# Altium project passthrough_module.PrjPcb
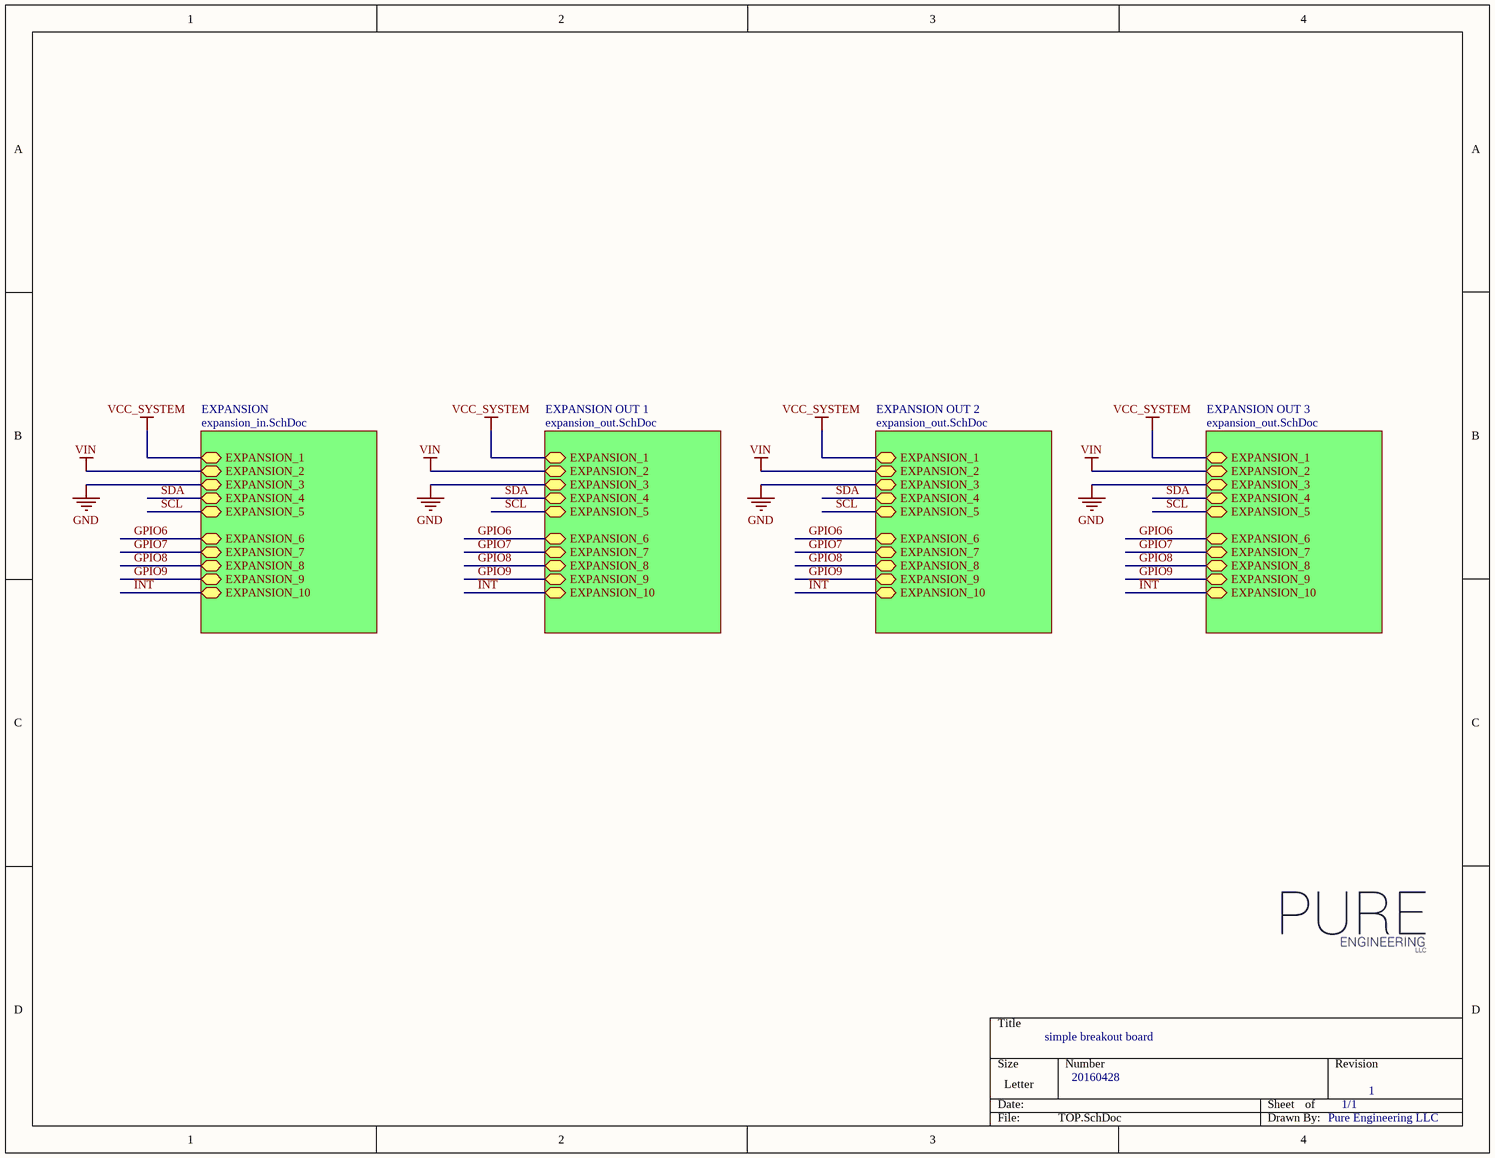
[diagram p0: TOP.SchDoc]
3 sheets, 4 parts. Net scope: hierarchical (ports join the sheet entries above them; power ports are global).
Board file: passthrough_module.PcbDoc
Sheets:
  TOP.SchDoc
    EXPANSION = expansion_in.SchDoc
    EXPANSION OUT 1 = expansion_out.SchDoc
    EXPANSION OUT 2 = expansion_out.SchDoc
    EXPANSION OUT 3 = expansion_out.SchDoc

## Sheet TOP.SchDoc
size Letter; SheetNumber: 1; SheetTotal: 4

### Sub-sheets
EXPANSION = expansion_in.SchDoc: EXPANSION_1, EXPANSION_2, EXPANSION_3, EXPANSION_4, EXPANSION_5, EXPANSION_10, EXPANSION_9, EXPANSION_8, EXPANSION_7, EXPANSION_6
EXPANSION OUT 1 = expansion_out.SchDoc: EXPANSION_1, EXPANSION_2, EXPANSION_3, EXPANSION_4, EXPANSION_5, EXPANSION_10, EXPANSION_9, EXPANSION_8, EXPANSION_7, EXPANSION_6
EXPANSION OUT 2 = expansion_out.SchDoc: EXPANSION_1, EXPANSION_2, EXPANSION_3, EXPANSION_4, EXPANSION_5, EXPANSION_10, EXPANSION_9, EXPANSION_8, EXPANSION_7, EXPANSION_6
EXPANSION OUT 3 = expansion_out.SchDoc: EXPANSION_1, EXPANSION_2, EXPANSION_3, EXPANSION_4, EXPANSION_5, EXPANSION_10, EXPANSION_9, EXPANSION_8, EXPANSION_7, EXPANSION_6

### Nets
GND: sheet EXPANSION/EXPANSION_3, sheet EXPANSION OUT 1/EXPANSION_3, sheet EXPANSION OUT 2/EXPANSION_3, sheet EXPANSION OUT 3/EXPANSION_3
VCC_SYSTEM: sheet EXPANSION/EXPANSION_1, sheet EXPANSION OUT 1/EXPANSION_1, sheet EXPANSION OUT 2/EXPANSION_1, sheet EXPANSION OUT 3/EXPANSION_1
VIN: sheet EXPANSION/EXPANSION_2, sheet EXPANSION OUT 1/EXPANSION_2, sheet EXPANSION OUT 2/EXPANSION_2, sheet EXPANSION OUT 3/EXPANSION_2
GPIO6: sheet EXPANSION/EXPANSION_6, sheet EXPANSION OUT 1/EXPANSION_6, sheet EXPANSION OUT 2/EXPANSION_6, sheet EXPANSION OUT 3/EXPANSION_6
GPIO7: sheet EXPANSION/EXPANSION_7, sheet EXPANSION OUT 1/EXPANSION_7, sheet EXPANSION OUT 2/EXPANSION_7, sheet EXPANSION OUT 3/EXPANSION_7
GPIO8: sheet EXPANSION/EXPANSION_8, sheet EXPANSION OUT 1/EXPANSION_8, sheet EXPANSION OUT 2/EXPANSION_8, sheet EXPANSION OUT 3/EXPANSION_8
GPIO9: sheet EXPANSION/EXPANSION_9, sheet EXPANSION OUT 1/EXPANSION_9, sheet EXPANSION OUT 2/EXPANSION_9, sheet EXPANSION OUT 3/EXPANSION_9
~{INT}: sheet EXPANSION/EXPANSION_10, sheet EXPANSION OUT 1/EXPANSION_10, sheet EXPANSION OUT 2/EXPANSION_10, sheet EXPANSION OUT 3/EXPANSION_10
SCL: sheet EXPANSION/EXPANSION_5, sheet EXPANSION OUT 1/EXPANSION_5, sheet EXPANSION OUT 2/EXPANSION_5, sheet EXPANSION OUT 3/EXPANSION_5
SDA: sheet EXPANSION/EXPANSION_4, sheet EXPANSION OUT 1/EXPANSION_4, sheet EXPANSION OUT 2/EXPANSION_4, sheet EXPANSION OUT 3/EXPANSION_4

### Notes on the sheet
- simple breakout board
- 20160428
- 1/1
- 1
- Pure Engineering LLC

## Sheet expansion_in.SchDoc
size A
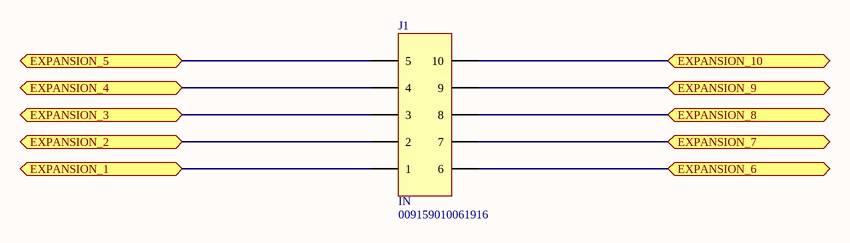
[diagram p1: expansion_in.SchDoc]

### Parts
J1  IN  [009159010061916_BACK]

### Ports
EXPANSION_1, EXPANSION_2, EXPANSION_3, EXPANSION_4, EXPANSION_5, EXPANSION_6, EXPANSION_7, EXPANSION_8, EXPANSION_9, EXPANSION_10

### Nets
GND: J1.3 ; port EXPANSION_3
VCC_SYSTEM: J1.1 ; port EXPANSION_1
VIN: J1.2 ; port EXPANSION_2
GPIO6: J1.6 ; port EXPANSION_6
GPIO7: J1.7 ; port EXPANSION_7
GPIO8: J1.8 ; port EXPANSION_8
GPIO9: J1.9 ; port EXPANSION_9
~{INT}: J1.10 ; port EXPANSION_10
SCL: J1.5 ; port EXPANSION_5
SDA: J1.4 ; port EXPANSION_4

### Library data of the parts
J1 = 009159010061916: CONN SSL BRIDGE 10POS 2MM Open Ended Card Edge: 00-9159; MANUFACTURER: AVX Corporation; VALIDATED BY: NV; DISTRIBUTOR: DIGI-KEY; DISTRIBUTOR P/N: 478-8659-ND; CREATED BY: SO 7 2014; COST: 1.06; MANUFACTURER P/N: 009159010061916

## Sheet expansion_out.SchDoc
size A
Used 3 times, as channels EXPANSION OUT 1, EXPANSION OUT 2, EXPANSION OUT 3. Parts and nets are listed once, with the designators drawn on the sheet.
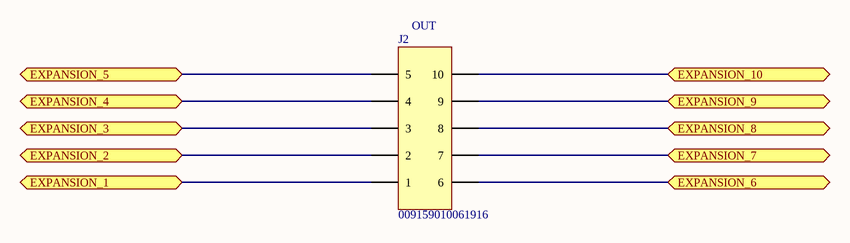
[diagram p2: expansion_out.SchDoc]

### Parts
J2  OUT  [009159010061916_FRONT]

### Ports
EXPANSION_1, EXPANSION_2, EXPANSION_3, EXPANSION_4, EXPANSION_5, EXPANSION_6, EXPANSION_7, EXPANSION_8, EXPANSION_9, EXPANSION_10

### Nets
EXPANSION_1: J2.1 ; port EXPANSION_1
EXPANSION_2: J2.2 ; port EXPANSION_2
EXPANSION_3: J2.3 ; port EXPANSION_3
EXPANSION_4: J2.4 ; port EXPANSION_4
EXPANSION_5: J2.5 ; port EXPANSION_5
EXPANSION_6: J2.6 ; port EXPANSION_6
EXPANSION_7: J2.7 ; port EXPANSION_7
EXPANSION_8: J2.8 ; port EXPANSION_8
EXPANSION_9: J2.9 ; port EXPANSION_9
EXPANSION_10: J2.10 ; port EXPANSION_10

### Channels
EXPANSION OUT 1: designators end in _EXPANSION_OUT_1; ports EXPANSION_1=VCC_SYSTEM EXPANSION_2=VIN EXPANSION_3=GND EXPANSION_4=SDA EXPANSION_5=SCL EXPANSION_6=GPIO6 EXPANSION_7=GPIO7 EXPANSION_8=GPIO8 EXPANSION_9=GPIO9 EXPANSION_10=~{INT}
EXPANSION OUT 2: designators end in _EXPANSION_OUT_2; ports EXPANSION_1=VCC_SYSTEM EXPANSION_2=VIN EXPANSION_3=GND EXPANSION_4=SDA EXPANSION_5=SCL EXPANSION_6=GPIO6 EXPANSION_7=GPIO7 EXPANSION_8=GPIO8 EXPANSION_9=GPIO9 EXPANSION_10=~{INT}
EXPANSION OUT 3: designators end in _EXPANSION_OUT_3; ports EXPANSION_1=VCC_SYSTEM EXPANSION_2=VIN EXPANSION_3=GND EXPANSION_4=SDA EXPANSION_5=SCL EXPANSION_6=GPIO6 EXPANSION_7=GPIO7 EXPANSION_8=GPIO8 EXPANSION_9=GPIO9 EXPANSION_10=~{INT}

### Library data of the parts
J2 = 009159010061916: as J1 on sheet expansion_in; DISTRIBUTOR: DIGI-KEY; DISTRIBUTOR P/N: 478-8659-ND; CREATED BY: SO 7 2014; COST: 1.06; MANUFACTURER P/N: 009159010061916

## Nets that join several sheets
GND: expansion_in (J1.3), EXPANSION OUT 1 (J2_EXPANSION_OUT_1.3), EXPANSION OUT 2 (J2_EXPANSION_OUT_2.3), EXPANSION OUT 3 (J2_EXPANSION_OUT_3.3)
VCC_SYSTEM: expansion_in (J1.1), EXPANSION OUT 1 (J2_EXPANSION_OUT_1.1), EXPANSION OUT 2 (J2_EXPANSION_OUT_2.1), EXPANSION OUT 3 (J2_EXPANSION_OUT_3.1)
VIN: expansion_in (J1.2), EXPANSION OUT 1 (J2_EXPANSION_OUT_1.2), EXPANSION OUT 2 (J2_EXPANSION_OUT_2.2), EXPANSION OUT 3 (J2_EXPANSION_OUT_3.2)
GPIO6: expansion_in (J1.6), EXPANSION OUT 1 (J2_EXPANSION_OUT_1.6), EXPANSION OUT 2 (J2_EXPANSION_OUT_2.6), EXPANSION OUT 3 (J2_EXPANSION_OUT_3.6)
GPIO7: expansion_in (J1.7), EXPANSION OUT 1 (J2_EXPANSION_OUT_1.7), EXPANSION OUT 2 (J2_EXPANSION_OUT_2.7), EXPANSION OUT 3 (J2_EXPANSION_OUT_3.7)
GPIO8: expansion_in (J1.8), EXPANSION OUT 1 (J2_EXPANSION_OUT_1.8), EXPANSION OUT 2 (J2_EXPANSION_OUT_2.8), EXPANSION OUT 3 (J2_EXPANSION_OUT_3.8)
GPIO9: expansion_in (J1.9), EXPANSION OUT 1 (J2_EXPANSION_OUT_1.9), EXPANSION OUT 2 (J2_EXPANSION_OUT_2.9), EXPANSION OUT 3 (J2_EXPANSION_OUT_3.9)
~{INT}: expansion_in (J1.10), EXPANSION OUT 1 (J2_EXPANSION_OUT_1.10), EXPANSION OUT 2 (J2_EXPANSION_OUT_2.10), EXPANSION OUT 3 (J2_EXPANSION_OUT_3.10)
SCL: expansion_in (J1.5), EXPANSION OUT 1 (J2_EXPANSION_OUT_1.5), EXPANSION OUT 2 (J2_EXPANSION_OUT_2.5), EXPANSION OUT 3 (J2_EXPANSION_OUT_3.5)
SDA: expansion_in (J1.4), EXPANSION OUT 1 (J2_EXPANSION_OUT_1.4), EXPANSION OUT 2 (J2_EXPANSION_OUT_2.4), EXPANSION OUT 3 (J2_EXPANSION_OUT_3.4)